# EAGLE design smd-proto (EAGLE 8.0.0)
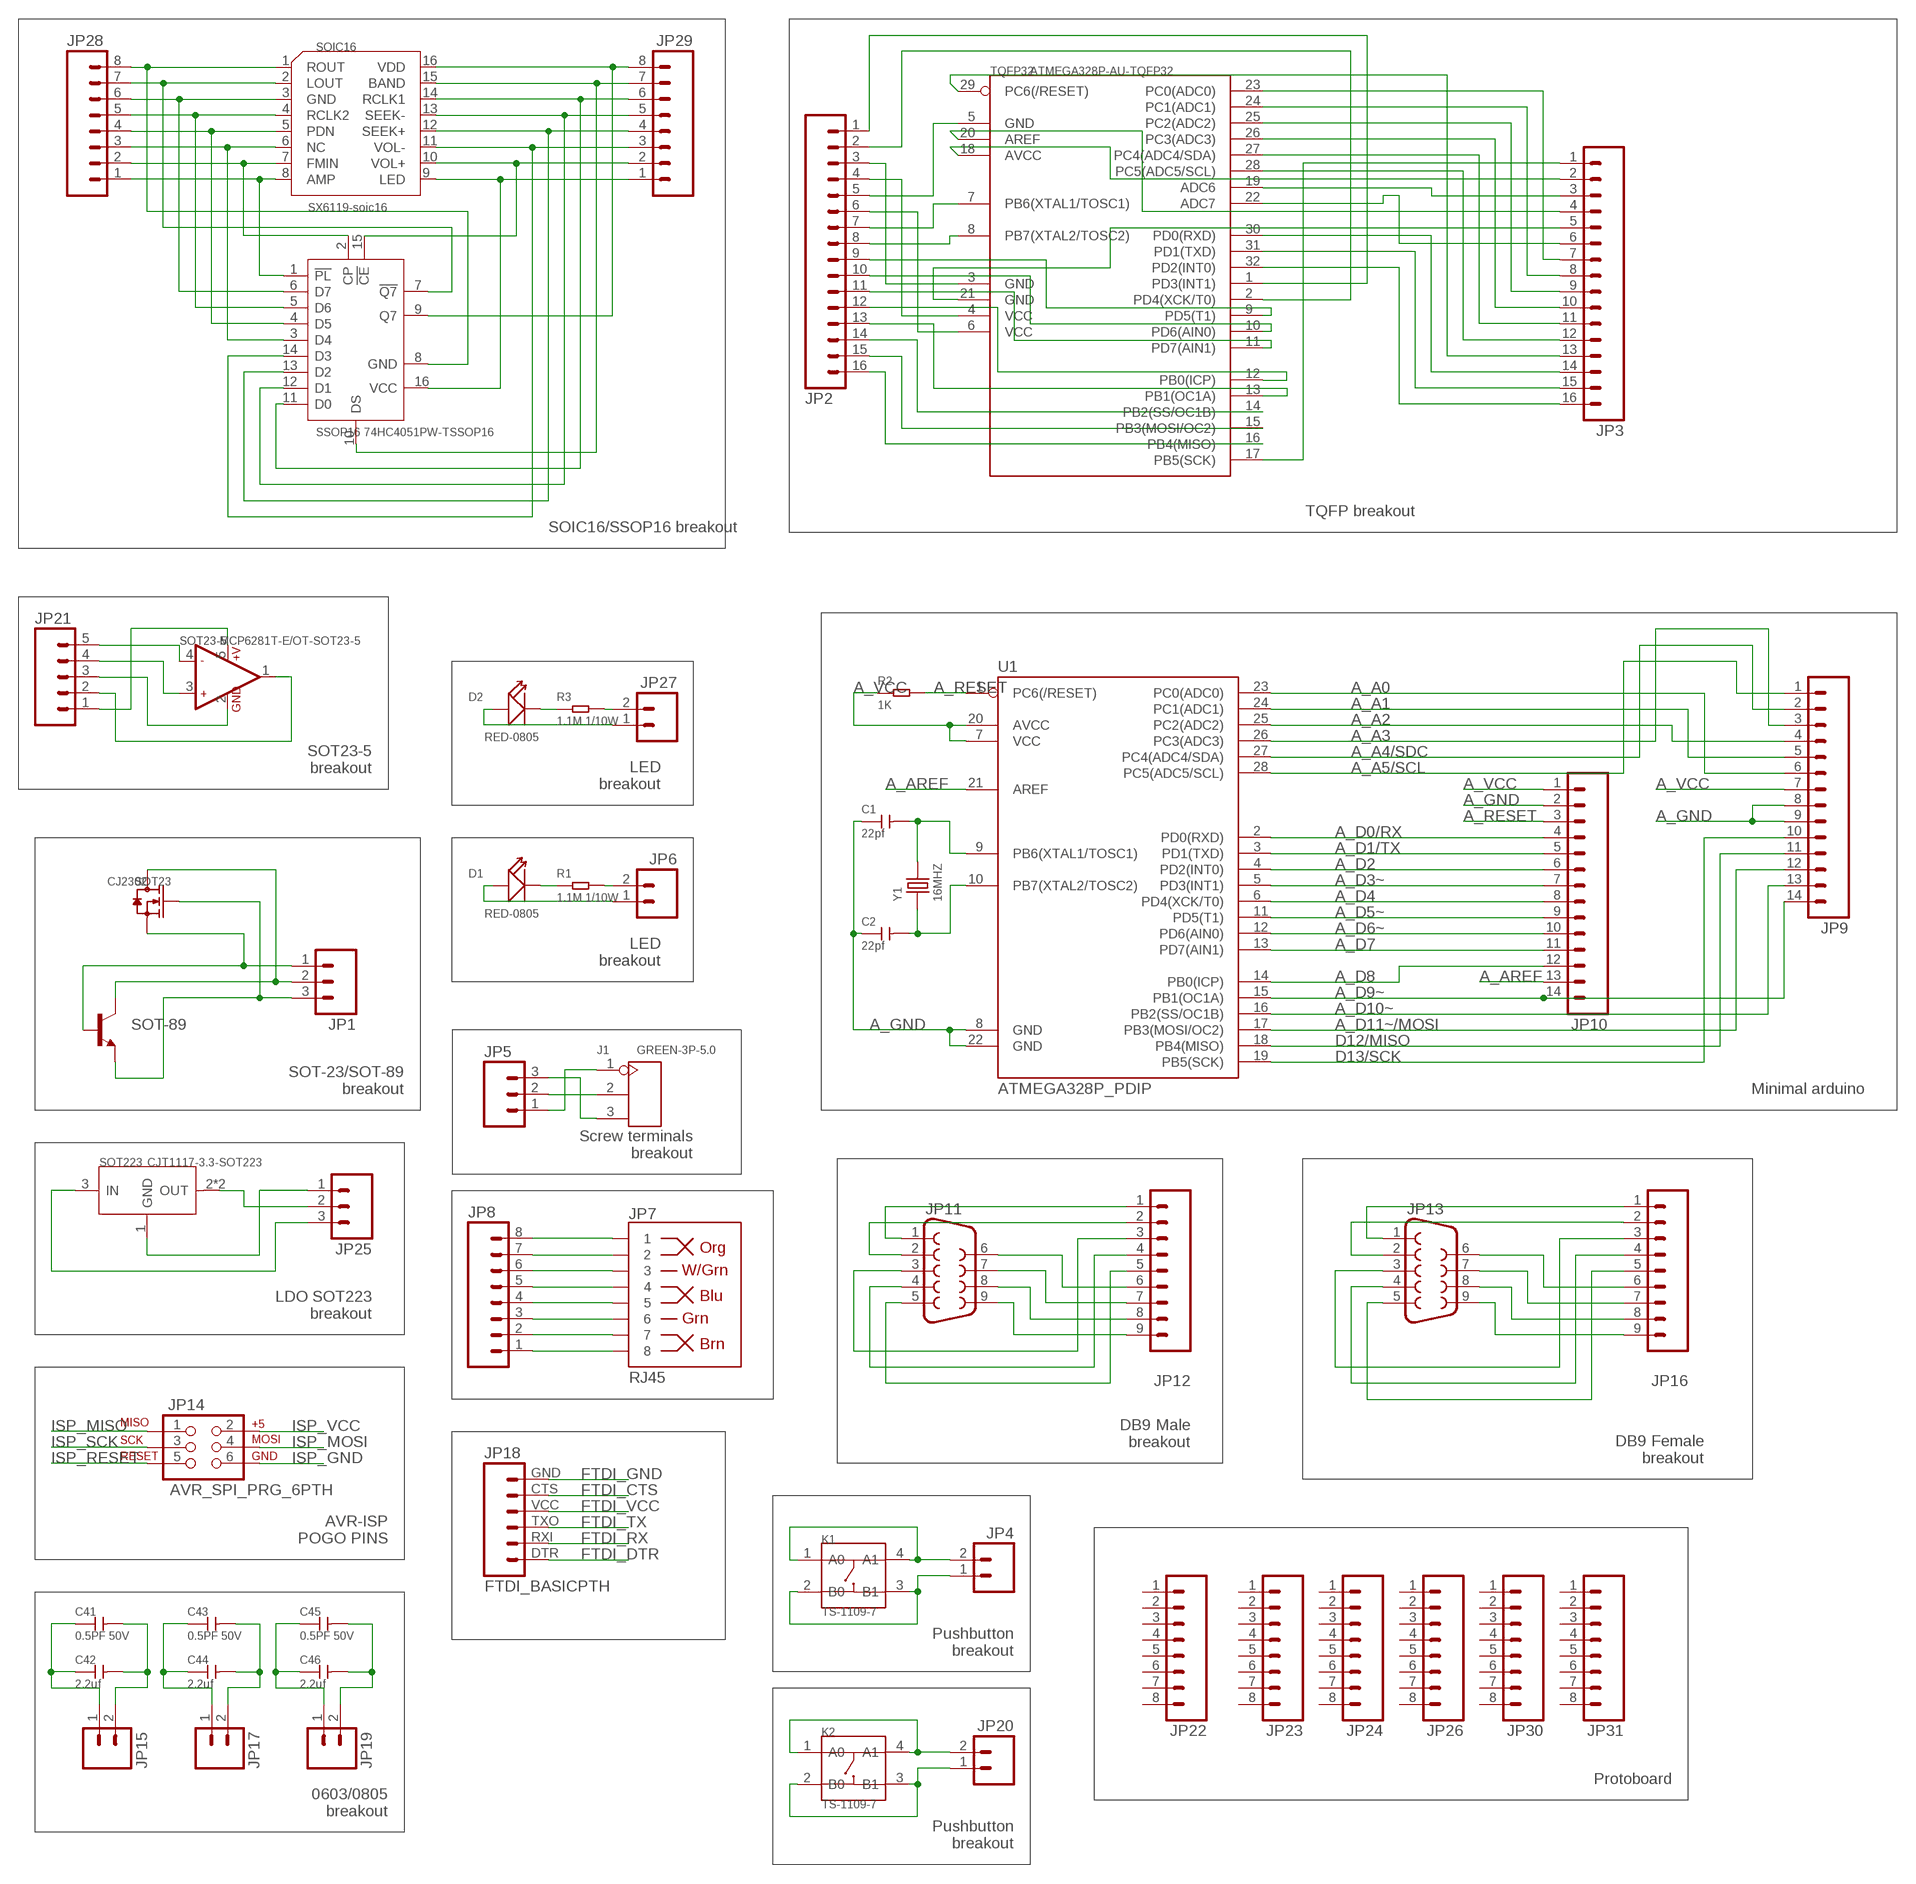
[diagram p0: schematic, sheet 1]

## Parts
C1  22pf  CERAMIC-22PF-50V-5%-NPO(0603)  [C0603]
C2  22pf  CERAMIC-22PF-50V-5%-NPO(0603)  [C0603]
C41  0.5PF 50V  CERAMIC-0.5PF-50V-0.1PF-NPO(0603)  [C0603]
C42  2.2uf  CERAMIC-2.2UF-25V-10%-X7R(0805)  [C0805]
C43  0.5PF 50V  CERAMIC-0.5PF-50V-0.1PF-NPO(0603)  [C0603]
C44  2.2uf  CERAMIC-2.2UF-25V-10%-X7R(0805)  [C0805]
C45  0.5PF 50V  CERAMIC-0.5PF-50V-0.1PF-NPO(0603)  [C0603]
C46  2.2uf  CERAMIC-2.2UF-25V-10%-X7R(0805)  [C0805]
D1  RED-0805  SMD-LED-CLEAR-RED(0805)  [LED-0805]
D2  RED-0805  SMD-LED-CLEAR-RED(0805)  [LED-0805]
J1  GREEN-3P-5.0  SCREW-TERMINAL-GREEN(3P-5.0)  [H3-5.0-15.5X8.0MM]
JP1  M03PTH  [1X03]
JP2  M16PTH  [1X16]
JP3  M16PTH  [1X16]
JP4  M02PTH  [1X02]
JP5  M03PTH  [1X03]
JP6  M02PTH  [1X02]
JP7  RJ45  RJ45-8PTH  [RJ45-8]
JP8  M08  [1X08_ROUND]
JP9  M14  [1X14]
JP10  M14  [1X14]
JP11  DB9MALE  [DB9_MALE]
JP12  M09  [1X09]
JP13  DB9FEMALE  [DB9]
JP14  AVR_SPI_PRG_6PTH  [2X3]
JP15  M02PTH  [1X02]
JP16  M09  [1X09]
JP17  M02PTH  [1X02]
JP18  FTDI_BASICPTH  [FTDI_BASIC]
JP19  M02PTH  [1X02]
JP20  M02PTH  [1X02]
JP21  M05PTH  [1X05]
JP22  M08NO_SILK_FEMALE_PTH  [1X08_NO_SILK]
JP23  M08NO_SILK_FEMALE_PTH  [1X08_NO_SILK]
JP24  M08NO_SILK_FEMALE_PTH  [1X08_NO_SILK]
JP25  M03PTH  [1X03]
JP26  M08NO_SILK_FEMALE_PTH  [1X08_NO_SILK]
JP27  M02PTH  [1X02]
JP28  M08  [1X08_ROUND]
JP29  M08  [1X08_ROUND]
JP30  M08NO_SILK_FEMALE_PTH  [1X08_NO_SILK]
JP31  M08NO_SILK_FEMALE_PTH  [1X08_NO_SILK]
K1  TS-1109-7  DIP-BUTTON-TOP-BLACK(4P-D6.2MM)  [SW4-6.2X6.2X5.0MM]
K2  TS-1109-7  DIP-BUTTON-TOP-BLACK(4P-D6.2MM)  [SW4-6.2X6.2X5.0MM]
R1  1.1M 1/10W  SMD-RES-1.1M-1%-1/10W(0603)  [R0603]
R2  1K  SMD-RES-5.6K-5%-1/10W(0603)  [R0603]
R3  1.1M 1/10W  SMD-RES-1.1M-1%-1/10W(0603)  [R0603]
SOIC16  SX6119-soic16  AMPLIFIER-SX6119(SOIC16)  [SOIC16-1.27-10X3.9MM]
SOT23  CJ2302  SMD-MOSFET-N-CH-20V-2.1A-CJ2302(SOT-23)  [SOT-23]
SOT23-5  MCP6281T-E/OT-SOT23-5  AMPLIFIER-MCP6281T-E/OT(SOT23-5)  [SOT-23-5]
SOT223  CJT1117-3.3-SOT223  PMIC-CJT1117-3.3(SOT223)  [SOT-223]
SOT-89  TRANSISTOR_NPNSOT89  [SOT89]
SSOP16  74HC4051PW-TSSOP16  LOGIC-74HC4051PW(TSSOP16)  [TSSOP16-0.65-5X4.4MM]
TQFP32  ATMEGA328P-AU-TQFP32  MCU-ATMEGA328P-AU(TQFP32)  [TQFP32-0.8-7X7MM]
U1  ATMEGA328P_PDIP  [DIL28-3]
Y1  16MHZ  SMD-CRYSTAL-16MHZ-8PF-20PPM-40R(2P-5.0X3.2MM)  [X2-SMD-5.0X3.2X1.3MM]

## Nets
A_A0: JP9.6 U1.23(PC0(ADC0))
A_A1: JP9.5 U1.24(PC1(ADC1))
A_A2: JP9.4 U1.25(PC2(ADC2))
A_A3: JP9.3 U1.26(PC3(ADC3))
A_A4/SDC: JP9.2 U1.27(PC4(ADC4/SDA))
A_A5/SCL: JP9.1 U1.28(PC5(ADC5/SCL))
A_AREF: JP10.13 U1.21(AREF)
A_D0/RX: JP10.4 U1.2(PD0(RXD))
A_D1/TX: JP10.5 U1.3(PD1(TXD))
A_D2: JP10.6 U1.4(PD2(INT0))
A_D3~: JP10.7 U1.5(PD3(INT1))
A_D4: JP10.8 U1.6(PD4(XCK/T0))
A_D5~: JP10.9 U1.11(PD5(T1))
A_D6~: JP10.10 U1.12(PD6(AIN0))
A_D7: JP10.11 U1.13(PD7(AIN1))
A_D8: JP10.12 U1.14(PB0(ICP))
A_D9~: JP9.14 JP10.14 U1.15(PB1(OC1A))
A_D10~: JP9.13 U1.16(PB2(SS/OC1B))
A_D11~/MOSI: JP9.12 U1.17(PB3(MOSI/OC2))
A_GND: C1.1 C2.1 JP9.8 JP9.9 JP10.2 U1.8(GND) U1.22(GND)
A_RESET: JP10.3 R2.2 U1.1(PC6(/RESET))
A_VCC: JP9.7 JP10.1 R2.1 U1.7(VCC) U1.20(AVCC)
D12/MISO: JP9.11 U1.18(PB4(MISO))
D13/SCK: JP9.10 U1.19(PB5(SCK))
FTDI_CTS: JP18.CTS
FTDI_DTR: JP18.DTR
FTDI_GND: JP18.GND
FTDI_RX: JP18.RXI
FTDI_TX: JP18.TXO
FTDI_VCC: JP18.VCC
GND: JP28.8 SOIC16.1(ROUT) SSOP16.8(GND)
ISP_GND: JP14.6
ISP_MISO: JP14.1
ISP_MOSI: JP14.4
ISP_RESET: JP14.5
ISP_SCK: JP14.3
ISP_VCC: JP14.2
N$1: JP21.5 SOT23-5.4(-IN1)
N$2: JP2.1 TQFP32.1(PD3(INT1))
N$3: JP2.2 TQFP32.2(PD4(XCK/T0))
N$4: JP2.3 TQFP32.3(GND)
N$5: JP2.4 TQFP32.4(VCC)
N$6: JP2.5 TQFP32.5(GND)
N$7: JP2.6 TQFP32.6(VCC)
N$8: JP2.7 TQFP32.7(PB6(XTAL1/TOSC1))
N$9: JP2.8 TQFP32.8(PB7(XTAL2/TOSC2))
N$10: JP2.9 TQFP32.9(PD5(T1))
N$11: JP2.11 TQFP32.11(PD7(AIN1))
N$12: JP2.10 TQFP32.10(PD6(AIN0))
N$13: JP2.12 TQFP32.12(PB0(ICP))
N$14: JP2.13 TQFP32.13(PB1(OC1A))
N$15: JP2.14 TQFP32.14(PB2(SS/OC1B))
N$16: JP21.2 SOT23-5.1(OUT1)
N$17: JP21.1 SOT23-5.5(+V)
N$18: JP2.15 TQFP32.15(PB3(MOSI/OC2))
N$19: JP21.4 SOT23-5.3(+IN1)
N$20: JP21.3 SOT23-5.2(GND)
N$21: JP1.3 SOT23.1(G) SOT-89.3(E)
N$22: JP2.16 TQFP32.16(PB4(MISO))
N$23: JP1.2 SOT23.3(D) SOT-89.2(C)
N$24: JP3.1 TQFP32.17(PB5(SCK))
N$25: JP3.2 TQFP32.18(AVCC)
N$26: JP29.6 SOIC16.14(RCLK1) SSOP16.11(D0)
N$27: JP3.3 TQFP32.19(ADC6)
N$28: JP3.4 TQFP32.20(AREF)
N$29: JP3.5 TQFP32.21(GND)
N$30: JP3.6 TQFP32.22(ADC7)
N$31: JP3.7 TQFP32.23(PC0(ADC0))
N$32: JP3.8 TQFP32.24(PC1(ADC1))
N$33: JP3.9 TQFP32.25(PC2(ADC2))
N$34: JP3.10 TQFP32.26(PC3(ADC3))
N$35: JP3.11 TQFP32.27(PC4(ADC4/SDA))
N$36: JP3.12 TQFP32.28(PC5(ADC5/SCL))
N$37: JP3.13 TQFP32.29(PC6(/RESET))
N$38: JP3.14 TQFP32.30(PD0(RXD))
N$39: JP3.15 TQFP32.31(PD1(TXD))
N$40: JP3.16 TQFP32.32(PD2(INT0))
N$41: JP4.1 K1.2(B0) K1.3(B1)
N$42: JP29.3 SOIC16.11(VOL-) SSOP16.14(D3)
N$43: C41.1 C42.1 JP15.1
N$44: C41.2 C42.2 JP15.2
N$45: C43.1 C44.1 JP17.1
N$46: C43.2 C44.2 JP17.2
N$47: C45.1 C46.1 JP19.1
N$48: JP28.7 SOIC16.2(LOUT) SSOP16.7(!Q7)
N$49: JP28.2 SOIC16.7(FMIN) SSOP16.2(CP)
N$50: C45.2 C46.2 JP19.2
N$51: JP29.7 SOIC16.15(BAND) SSOP16.10(DS)
N$52: JP4.2 K1.1(A0) K1.4(A1)
N$53: JP29.5 SOIC16.13(SEEK-) SSOP16.12(D1)
N$54: JP29.4 SOIC16.12(SEEK+) SSOP16.13(D2)
N$55: D1.+ JP6.1
N$56: D1.- R1.1
N$57: JP28.6 SOIC16.3(GND) SSOP16.6(D7)
N$58: JP6.2 R1.2
N$59: JP28.5 SOIC16.4(RCLK2) SSOP16.5(D6)
N$60: J1.2 JP5.2
N$61: J1.1 JP5.1
N$62: J1.3 JP5.3
N$63: JP7.1 JP8.8
N$64: JP7.2 JP8.7
N$65: JP7.3 JP8.6
N$66: JP7.4 JP8.5
N$67: JP7.5 JP8.4
N$68: JP7.6 JP8.3
N$69: JP7.7 JP8.2
N$70: JP1.1 SOT23.2(S) SOT-89.1(B)
N$71: JP28.4 SOIC16.5(PDN) SSOP16.4(D5)
N$72: JP7.8 JP8.1
N$73: C1.2 U1.9(PB6(XTAL1/TOSC1)) Y1.2
N$74: C2.2 U1.10(PB7(XTAL2/TOSC2)) Y1.1
N$75: JP28.3 SOIC16.6(NC) SSOP16.3(D4)
N$76: JP11.1 JP12.1
N$77: JP11.2 JP12.2
N$78: JP11.3 JP12.3
N$79: JP11.4 JP12.4
N$80: JP28.1 SOIC16.8(AMP) SSOP16.1(!PL)
N$82: JP11.5 JP12.5
N$83: JP11.6 JP12.6
N$84: JP11.7 JP12.7
N$85: JP11.8 JP12.8
N$86: JP11.9 JP12.9
N$87: JP13.1 JP16.1
N$88: JP13.2 JP16.2
N$89: JP13.3 JP16.3
N$90: JP13.4 JP16.4
N$91: JP13.5 JP16.5
N$92: JP13.6 JP16.6
N$93: JP13.7 JP16.7
N$94: JP13.8 JP16.8
N$95: JP13.9 JP16.9
N$97: JP29.2 SOIC16.10(VOL+) SSOP16.15(!CE)
N$103: JP20.1 K2.2(B0) K2.3(B1)
N$104: JP20.2 K2.1(A0) K2.4(A1)
N$105: D2.+ JP27.1
N$106: D2.- R3.1
N$107: JP25.2 SOT223.2(OUT) SOT223.TER(OUT)
N$108: JP27.2 R3.2
N$111: JP29.8 SOIC16.16(VDD) SSOP16.9(Q7)
N$304: JP25.1 SOT223.1(GND)
N$306: JP25.3 SOT223.3(IN)
VCC: JP29.1 SOIC16.9(LED) SSOP16.16(VCC)
Unconnected: JP22.1 JP22.2 JP22.3 JP22.4 JP22.5 JP22.6 JP22.7 JP22.8 JP23.1 JP23.2 JP23.3 JP23.4 JP23.5 JP23.6 JP23.7 JP23.8 JP24.1 JP24.2 JP24.3 JP24.4 JP24.5 JP24.6 JP24.7 JP24.8 JP26.1 JP26.2 JP26.3 JP26.4 JP26.5 JP26.6 JP26.7 JP26.8 JP30.1 JP30.2 JP30.3 JP30.4 JP30.5 JP30.6 JP30.7 JP30.8 JP31.1 JP31.2 JP31.3 JP31.4 JP31.5 JP31.6 JP31.7 JP31.8

## Notes on the sheet
- TQFP breakout
- SOIC16/SSOP16 breakout
- SOT23-5
  breakout
- LED
  breakout
- LED
  breakout
- SOT-23/SOT-89
  breakout
- Minimal arduino
- Screw terminals
  breakout
- LDO SOT223
  breakout
- DB9 Male
  breakout
- DB9 Female
  breakout
- AVR-ISP
  POGO PINS
- Pushbutton
  breakout
- Protoboard
- 0603/0805
  breakout
- Pushbutton
  breakout

## Library data of the parts
C1 C2 = Seeed-OPL-Capacitor:CERAMIC-22PF-50V-5%-NPO(0603): 302010143
C41 C43 C45 = Seeed-OPL-Capacitor:CERAMIC-0.5PF-50V-0.1PF-NPO(0603): 302010115
C42 C44 C46 = Seeed-OPL-Capacitor:CERAMIC-2.2UF-25V-10%-X7R(0805): 302010148; MPN: CC0805KKX7R8BB225
D1 D2 = Seeed-OPL-Diode:SMD-LED-CLEAR-RED(0805): 304090046; MPN: 17-215SURC/S530-A2/TR8
J1 = Seeed-OPL-Connector:SCREW-TERMINAL-GREEN(3P-5.0): 320110029
JP1 JP5 JP25 = SparkFun-Connectors:M03: Header 3 Standard 3-pin 0.1" header. Use with straight break away headers (SKU : PRT-00116), right angle break away headers (PRT-00553), swiss pins (PRT-00743), machine pins (PRT-00117), and female headers (PRT-00115). Molex polarized connector foot print use with SKU : PRT-08232 with associated crimp pins and housings.
JP2 JP3 = SparkFun-Connectors:M16: 1x16 .1" header
JP4 JP6 JP15 JP17 JP19 JP20 JP27 = SparkFun-Connectors:M02: Standard 2-pin 0.1" header. Use with - straight break away headers ( PRT-00116) - right angle break away headers (PRT-00553) - swiss pins (PRT-00743) - machine pins (PRT-00117) - female headers (PRT-00115) Molex polarized connector foot print use with: PRT-08233 with associated crimp pins and housings. 2.54_SCREWTERM for use with PRT-10571. 3.5mm Screw Terminal footprints for PRT-08084 5mm Screw Terminal footprints for use with PRT-08432
JP7 = SparkFun-Connectors:RJ45-8: RJ45 Jack Simple RJ45, 8-pin connection - connector for common Cat5, Cat5e, and Cat6 Ethernet cables. Footprint not yet proven in production. Connector sku is PRT-00643; Breakout PCB sku is BOB-00716.; PROD_ID: CONN-08506
JP8 JP28 JP29 = SparkFun-Connectors:M08: Header 8 Standard 8-pin 0.1" header. Use with straight break away headers (SKU : PRT-00116), right angle break away headers (PRT-00553), swiss pins (PRT-00743), machine pins (PRT-00117), and female headers (PRT-00115).
JP9 JP10 = SparkFun-Connectors:M14: Header 14 Standard 14-pin 0.1" header. Use with straight break away headers (SKU : PRT-00116), right angle break away headers (PRT-00553), swiss pins (PRT-00743), machine pins (PRT-00117), and female headers (PRT-00115).
JP11 = SparkFun-Connectors:DB9: DB9 Connector Standard DB9 (D-Sub 9) serial connector. Can be used for CAN bus as well as RS485 and RS232. Footprint production proven. Spark Fun Electronics SKU : PRT-00429; PROD_ID: CONN-09904
JP12 JP16 = SparkFun-Connectors:M09: Header 9 Standard 9-pin 0.1" header. Use with straight break away headers (SKU : PRT-00116), right angle break away headers (PRT-00553), swiss pins (PRT-00743), machine pins (PRT-00117), and female headers (PRT-00115).
JP13 = SparkFun-Connectors:DB9: DB9 Connector Standard DB9 (D-Sub 9) serial connector. Can be used for CAN bus as well as RS485 and RS232. Footprint production proven. Spark Fun Electronics SKU : PRT-00429; PROD_ID: CONN-08194
JP14 = SparkFun-Connectors:AVR_SPI_PRG_6: AVR ISP 6 Pin This is the reduced ISP connector for AVR programming. Common on Arduino. This footprint will take up less PCB space and can be used with a 10-pin to 6-pin adapter such as SKU: BOB-08508 **Special note about "TEST_POINT" package. The stop mask is on the top side, so if you want your programming test points to be on the bottom of your board, make sure to place this package on the bottom side of the board. This also ensure that the orientation to program from the bottom side will be correct.
JP18 = SparkFun-Connectors:FTDI_BASIC: FTDI Basic header with labels
JP21 = SparkFun-Connectors:M05: Header 5 Standard 5-pin 0.1" header. Use with straight break away headers (SKU : PRT-00116), right angle break away headers (PRT-00553), swiss pins (PRT-00743), machine pins (PRT-00117), and female headers (PRT-00115). Molex polarized connector foot print use with SKU : PRT-08230 with associated crimp pins and housings.
JP22-JP24 JP26 JP30 JP31 = SparkFun-Connectors:M08: Header 8 Standard 8-pin 0.1" header. Use with straight break away headers (SKU : PRT-00116), right angle break away headers (PRT-00553), swiss pins (PRT-00743), machine pins (PRT-00117), and female headers (PRT-00115).; PROD_ID: CONN-08438
K1 K2 = Seeed-OPL-Switch:DIP-BUTTON-TOP-BLACK(4P-D6.2MM): 311020032; MPN: TS-1109-7
R1 R3 = Seeed-OPL-Resistor:SMD-RES-1.1M-1%-1/10W(0603): 301010236; MPN: RC0603FR-071M1L
R2 = Seeed-OPL-Resistor:SMD-RES-5.6K-5%-1/10W(0603): 301010166; MPN: RC0603JR-075K6L; VALUE: 5.6K
SOIC16 = Seeed-OPL-ic:AMPLIFIER-SX6119(SOIC16): 310060020; MPN: SX6119
SOT23 = Seeed-OPL-Transistor:SMD-MOSFET-N-CH-20V-2.1A-CJ2302(SOT-23): 305030015; MPN: CJ2302
SOT23-5 = Seeed-OPL-ic:AMPLIFIER-MCP6281T-E/OT(SOT23-5): 310020012; MPN: MCP6281T-E/OT
SOT223 = Seeed-OPL-ic:PMIC-CJT1117-3.3(SOT223): 310030097; MPN: CJT1117-3.3
SOT-89 = SparkFun-DiscreteSemi:TRANSISTOR_NPN: Generic NPN BJT MMBT2222A - TRANS-08049 (SOT-23, 1A 40V) MPSA42 - TRANS-09116 (SOT-23, 500mA 300V) MMBT5088LT1G - TRANS-11160 (SOT-23, 50 mA 30V) BC547 - COM-08928 (TO-92 45V 100mA) (1.Collector 2.Base 3.Emitter) 2N3904 - COM-00521 (TO-92 40V 200mA) (1.Emitter 2.Base 3.Collector) P2N2222A - COM-12852 (TO-92 40V 600mA) (1.Collector 2.Base 3.Emitter)
SSOP16 = Seeed-OPL-ic:LOGIC-74HC4051PW(TSSOP16): 310070017; MPN: 74HC4051PW
TQFP32 = Seeed-OPL-ic:MCU-ATMEGA328P-AU(TQFP32): 310010049; MPN: ATMEGA328P-AU
U1 = SparkFun-DigitalIC:ATMEGA328P_PDIP: uC used in the Arduino 32kb flash, 1k EEPROM, 2k SRAM This is the through-hole version of this chip.
Y1 = Seeed-OPL-crystal-osctllator:SMD-CRYSTAL-16MHZ-8PF-20PPM-40R(2P-5.0X3.2MM): 306010054; MPN: X053201602002

## Board
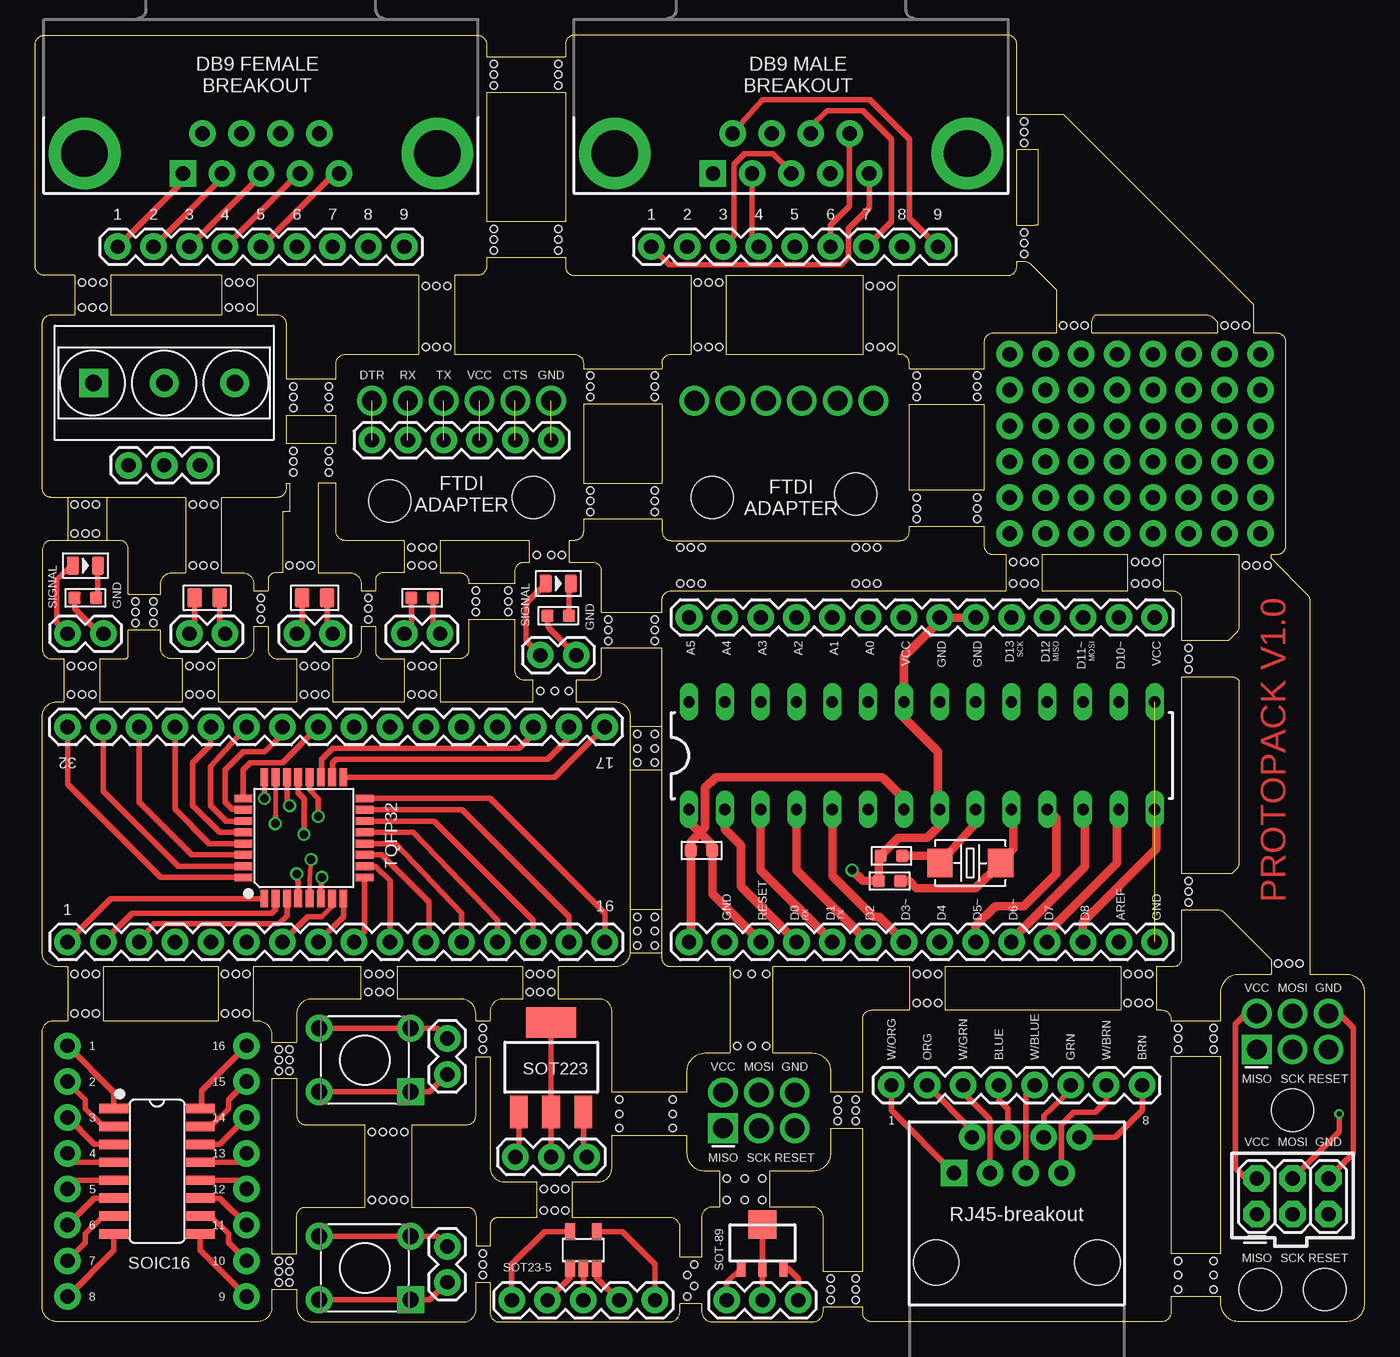
[diagram p1: board, top side]
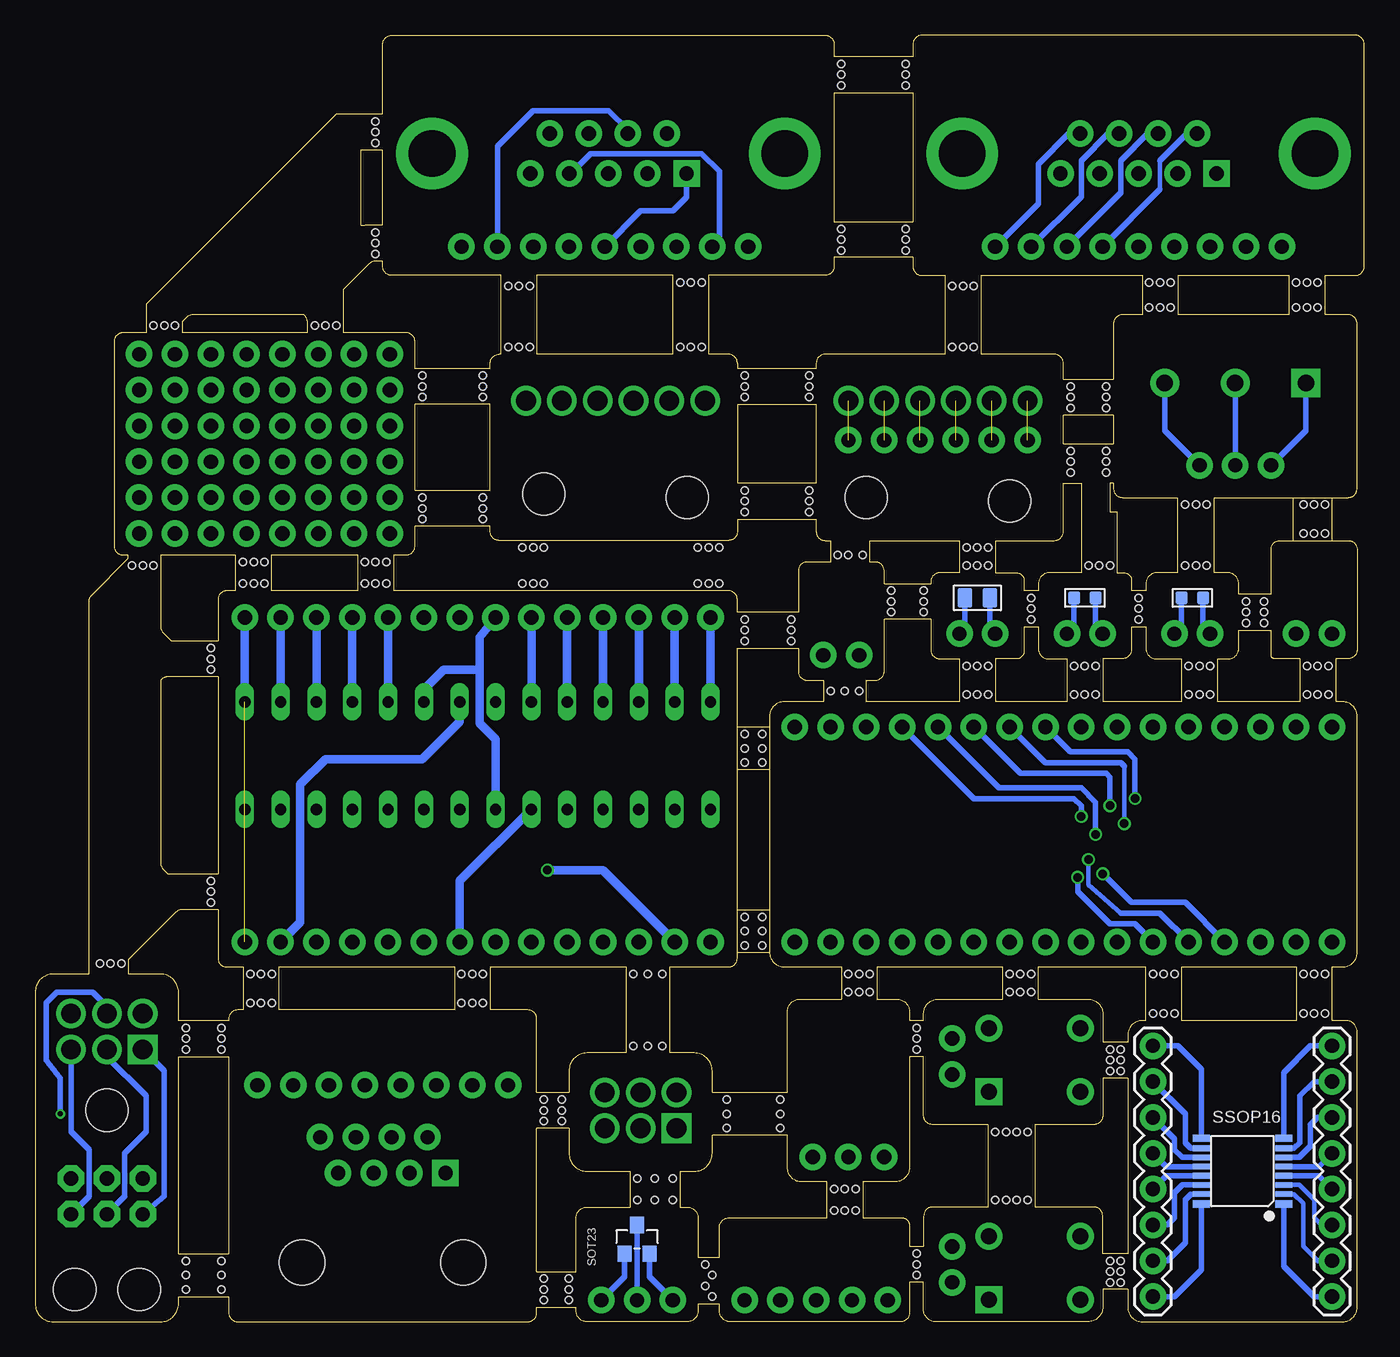
[diagram p2: board, bottom side, seen from below]

Size 94.23 x 91.19 mm. Coordinates in mm from the lower left corner, seen from the top.
Outline: 438 segments
Copper layers (1*16): Top 0.035mm / dielectric 1.5mm / Bottom 0.035mm
Design rules "dirt_cheap_dirty_boards.v1": minimum track width 5mil, minimum drill 12mil, track to track 5mil, track to pad 5mil, pad to pad 5mil, via to via 5mil, smd to smd 0mil, copper to edge 10mil, drill to drill 10mil, minimum pad ring 10mil, minimum via ring 6mil, stop-mask expansion 2mil, vias tented up to drill 25mil, thermal gap 10mil
Holes 0.5 mm at 17.27,19.3 17.27,18.54 17.27,17.78 18.03,19.3 18.03,18.54 18.03,17.78 17.27,2.79 17.27,3.56 17.27,4.32 18.03,4.32 18.03,3.56 18.03,2.79 2.79,21.84 3.56,21.84 4.32,21.84 2.79,24.64 3.56,24.64 4.32,24.64 14.99,21.84 14.22,21.84 13.46,21.84 14.99,24.64 14.22,24.64 13.46,24.64 23.62,23.37 24.38,23.37 25.15,23.37 25.15,24.64 24.38,24.64 23.62,24.64 31.75,20.83 31.75,20.07 31.75,19.3 31.75,4.83 31.75,4.06 31.75,3.3 35.05,24.64 35.81,24.64 36.58,24.64 36.58,23.37 35.81,23.37 35.05,23.37 36.07,9.4 36.83,9.4 37.59,9.4 37.59,7.87 36.83,7.87 36.07,7.87 23.88,13.46 24.64,13.46 25.4,13.46 26.16,13.46 23.88,8.64 24.64,8.64 25.4,8.64 26.16,8.64 46.23,3.3 46.74,2.54 46.23,1.78 49.02,8.64 50.29,8.64 51.56,8.64 41.4,13.72 41.4,14.73 41.4,15.75 45.21,15.75 45.21,14.73 45.21,13.72 49.02,10.16 50.29,10.16 51.56,10.16 49.78,19.56 50.8,19.56 51.82,19.56 51.82,24.64 50.8,24.64 49.78,24.64 56.9,15.75 56.9,14.99 56.9,14.22 58.17,14.22 58.17,14.99 58.17,15.75 56.39,3.05 56.39,2.29 56.39,1.52 58.17,3.05 58.17,2.29 58.17,1.52 81.03,2.29 81.03,3.3 81.03,4.32 83.57,2.29 83.57,3.3 83.57,4.32 81.03,20.83 81.03,20.07 81.03,19.3 83.57,19.3 83.57,20.07 83.57,20.83 81.79,31.24 81.79,30.48 81.79,29.72 78.99,24.64 78.23,24.64 77.47,24.64 64.01,22.61 63.25,22.61 62.48,22.61 62.48,24.64 63.25,24.64 64.01,24.64 42.67,26.67 42.67,27.69 42.67,28.7 43.94,27.69 43.94,26.67 43.94,28.7 42.67,39.62 42.67,40.64 42.67,41.66 43.94,40.64 43.94,39.62 43.94,41.66 23.62,51.31 23.62,49.78 16,49.78 16,51.31 2.54,46.48 7.11,49.53 7.11,51.05 8.38,51.05 8.38,49.53 3.3,46.48 4.06,46.48 4.06,44.45 3.3,44.45 2.54,44.45 10.92,46.48 11.68,46.48 12.45,46.48 12.45,44.45 11.68,44.45 10.92,44.45 19.05,46.48 19.81,46.48 20.57,46.48 20.57,44.45 19.81,44.45 19.05,44.45 26.67,46.48 27.43,46.48 28.19,46.48 28.19,44.45 27.43,44.45 26.67,44.45 26.67,54.86 27.43,54.86 28.19,54.86 28.19,53.59 27.43,53.59 26.67,53.59 2.79,57.91 3.56,57.91 4.32,57.91 4.32,55.88 3.56,55.88 2.79,55.88 45.72,54.86 46.48,54.86 47.24,54.86 47.24,52.32 46.48,52.32 45.72,52.32 58.17,54.86 58.93,54.86 59.69,54.86 59.69,52.32 58.93,52.32 58.17,52.32 59.18,73.41 59.94,73.41 60.71,73.41 60.71,69.09 59.94,69.09 59.18,69.09 46.99,73.66 47.75,73.66 48.51,73.66 48.51,69.09 47.75,69.09 46.99,69.09 27.69,73.41 28.45,73.41 29.21,73.41 29.21,69.09 28.45,69.09 27.69,69.09 3.3,73.66 4.06,73.66 4.83,73.66 4.83,71.88 4.06,71.88 3.3,71.88 13.72,73.66 14.48,73.66 15.24,73.66 15.24,71.88 14.48,71.88 13.72,71.88 11.18,57.91 11.94,57.91 12.7,57.91 12.7,53.59 11.94,53.59 11.18,53.59 32.51,89.15 32.51,88.39 32.51,87.63 37.08,89.15 37.08,88.39 37.08,87.63 32.51,77.47 32.51,76.71 32.51,75.95 37.08,77.47 37.08,76.71 37.08,75.95 18.29,66.29 18.29,65.53 18.29,64.77 20.83,66.29 20.83,65.53 20.83,64.77 18.29,61.72 18.29,60.96 18.29,60.2 20.83,61.72 20.83,60.96 20.83,60.2 62.48,67.06 62.48,66.29 62.48,65.53 66.8,67.06 66.8,66.29 66.8,65.53 62.48,58.42 62.48,57.66 62.48,56.9 66.8,58.42 66.8,57.66 66.8,56.9 39.37,67.06 39.37,66.29 39.37,65.53 43.94,67.06 43.94,66.29 43.94,65.53 39.37,58.93 39.37,58.17 39.37,57.4 43.94,58.93 43.94,58.17 43.94,57.4 70.87,53.85 70.1,53.85 69.34,53.85 70.87,52.32 70.1,52.32 69.34,52.32 79.5,52.32 78.74,52.32 77.98,52.32 79.5,53.85 78.74,53.85 77.98,53.85 19.56,53.59 18.8,53.59 18.03,53.59 7.11,50.29 8.38,50.29 16,50.55 23.62,50.55 89.66,25.4 88.9,25.4 88.14,25.4 87.38,53.59 86.61,53.59 85.85,53.59 81.79,46.23 81.79,46.99 81.79,47.75 77.47,22.61 78.23,22.61 78.99,22.61 70.1,83.57 70.1,84.33 70.1,85.09 84.33,70.61 85.09,70.61 85.85,70.61 70.1,77.22 70.1,76.45 70.1,75.69 72.9,70.61 73.66,70.61 74.42,70.61 46.74,4.06 35.81,44.7 36.83,44.7 37.85,44.7 35.56,54.36 36.58,54.36 37.34,54.36 33.53,51.82 33.53,51.05 33.53,50.29 31.24,50.29 31.24,51.05 31.24,51.82 40.64,49.78 40.64,49.02 40.64,48.26 43.94,48.26 43.94,49.02 43.94,49.78
Holes 3 mm at 89.15,14.99 86.87,2.29 91.44,2.29 25.15,58.17 35.31,58.42 48.01,58.42 58.17,58.67

### Footprints (pad centres in the part's own frame; a part is rotated, then mirrored left to right if it is on the bottom)
C0603 = smd 0.889 x 0.889: 1 0,0.762; 2 0,-0.762
C0805 = smd 1.397 x 1.016: 1 0,0.889; 2 0,-0.889
LED-0805 = smd 0.889 x 1.27: + -0.889,0; - 0.889,0
H3-5.0-15.5X8.0MM = drill 1.168 pad 2.032 square: 1 0,5 | drill 1.168 pad 2.032: 2 0,0; 3 0,-5
1X03 = drill 1.016 pad 1.88: 1 0,0; 2 2.54,0; 3 5.08,0
1X16 = drill 1.016 pad 1.88: 1 0,0; 2 2.54,0; 3 5.08,0; 4 7.62,0; 5 10.16,0; 6 12.7,0; 7 15.24,0; 8 17.78,0; 9 20.32,0; 10 22.86,0; 11 25.4,0; 12 27.94,0; 13 30.48,0; 14 33.02,0; 15 35.56,0; 16 38.1,0
1X02 = drill 1.016 pad 1.88: 1 0,0; 2 2.54,0
RJ45-8 = drill 1 pad 1.88 square: 1 -4.445,6.35 | drill 1 pad 1.88: 2 -3.175,8.89; 3 -1.905,6.35; 4 -0.635,8.89; 5 0.635,6.35; 6 1.905,8.89; 7 3.175,6.35; 8 4.445,8.89 | hole 3.2: -5.715,0; 5.715,0
1X08_ROUND = drill 1.016 pad 1.88: 1 0,0; 2 2.54,0; 3 5.08,0; 4 7.62,0; 5 10.16,0; 6 12.7,0; 7 15.24,0; 8 17.78,0
1X14 = drill 1.016 pad 1.88: 1 0,0; 2 2.54,0; 3 5.08,0; 4 7.62,0; 5 10.16,0; 6 12.7,0; 7 15.24,0; 8 17.78,0; 9 20.32,0; 10 22.86,0; 11 25.4,0; 12 27.94,0; 13 30.48,0; 14 33.02,0
DB9_MALE = drill 1.016 pad 1.88: 1 5.54,-1.42; 2 2.77,-1.42; 3 0,-1.42; 4 -2.77,-1.42; 6 4.15,1.42; 7 1.38,1.42; 8 -1.38,1.42; 9 -4.15,1.42 | drill 1.016 pad 1.88 square: 5 -5.54,-1.42 | drill 3.302 pad 5.08: G1 -12.5,0; G2 12.5,0
1X09 = drill 1.016 pad 1.88: 1 0,0; 2 2.54,0; 3 5.08,0; 4 7.62,0; 5 10.16,0; 6 12.7,0; 7 15.24,0; 8 17.78,0; 9 20.32,0
DB9 = drill 1.016 pad 1.88 square: 1 -5.54,-1.42 | drill 1.016 pad 1.88: 2 -2.77,-1.42; 3 0,-1.42; 4 2.77,-1.42; 5 5.54,-1.42; 6 -4.15,1.42; 7 -1.38,1.42; 8 1.38,1.42; 9 4.15,1.42 | drill 3.302 pad 5.08: G1 -12.5,0; G2 12.5,0
2X3 = drill 1.016 pad 1.88 octagon: 1 0,0; 2 0,2.54; 3 2.54,0; 4 2.54,2.54; 5 5.08,0; 6 5.08,2.54
FTDI_BASIC = drill 1.016 pad 1.88: CTS 10.16,0; DTR 0,0; GND 12.7,0; RXI 2.54,0; TXO 5.08,0; VCC 7.62,0
1X05 = drill 1.016 pad 1.88: 1 0,0; 2 2.54,0; 3 5.08,0; 4 7.62,0; 5 10.16,0
1X08_NO_SILK = drill 1.016 pad 1.88: 1 0,0; 2 2.54,0; 3 5.08,0; 4 7.62,0; 5 10.16,0; 6 12.7,0; 7 15.24,0; 8 17.78,0
SW4-6.2X6.2X5.0MM = drill 1.143 pad 1.905 square: 1 -3.25,2.25 | drill 1.143 pad 1.905: 2 -3.25,-2.25; 3 3.25,-2.25; 4 3.25,2.25
R0603 = smd 0.889 x 0.889: 1 0,0.762; 2 0,-0.762
SOIC16-1.27-10X3.9MM = smd 0.66 x 2.032: 1 -4.445,-3.073; 2 -3.175,-3.073; 3 -1.905,-3.073; 4 -0.635,-3.073; 5 0.635,-3.073; 6 1.905,-3.073; 7 3.175,-3.073; 8 4.445,-3.073; 9 4.445,3.073; 10 3.175,3.073; 11 1.905,3.073; 12 0.635,3.073; 13 -0.635,3.073; 14 -1.905,3.073; 15 -3.175,3.073; 16 -4.445,3.073
SOT-23 = smd 1.016 x 1.143: 1 -0.889,-1.016; 2 0.889,-1.016; 3 0,1.016
SOT-23-5 = smd 0.69 x 1.2: 1 -0.95,-1.3; 2 0,-1.3; 3 0.95,-1.3; 4 0.95,1.3; 5 -0.95,1.3
SOT-223 = smd 1.27 x 2.286: 1 -2.286,-3.175; 2 0,-3.175; 3 2.286,-3.175 | smd 3.556 x 2.159: TER 0,3.175
SOT89 = smd 0.58 x 1.2: 1 -1.5,-1.8; 2 0,-1.8; 3 1.5,-1.8 | smd 2 x 2: 4 0,1.3
TSSOP16-0.65-5X4.4MM = smd 0.5 x 1.2: 1 -2.325,-2.925; 8 2.325,-2.925; 9 2.325,2.925; 16 -2.325,2.925 | smd 0.4 x 1.2: 2 -1.625,-2.925; 3 -0.975,-2.925; 4 -0.325,-2.925; 5 0.325,-2.925; 6 0.975,-2.925; 7 1.625,-2.925; 10 1.625,2.925; 11 0.975,2.925; 12 0.325,2.925; 13 -0.325,2.925; 14 -0.975,2.925; 15 -1.625,2.925
TQFP32-0.8-7X7MM = smd 1.27 x 0.559: 1 -4.293,2.8; 2 -4.293,2; 3 -4.293,1.2; 4 -4.293,0.4; 5 -4.293,-0.4; 6 -4.293,-1.2; 7 -4.293,-2; 8 -4.293,-2.8; 17 4.293,-2.8; 18 4.293,-2; 19 4.293,-1.2; 20 4.293,-0.4; 21 4.293,0.4; 22 4.293,1.2; 23 4.293,2; 24 4.293,2.8 | smd 0.559 x 1.27: 9 -2.8,-4.293; 10 -2,-4.293; 11 -1.2,-4.293; 12 -0.4,-4.293; 13 0.4,-4.293; 14 1.2,-4.293; 15 2,-4.293; 16 2.8,-4.293; 25 2.8,4.293; 26 2,4.293; 27 1.2,4.293; 28 0.4,4.293; 29 -0.4,4.293; 30 -1.2,4.293; 31 -2,4.293; 32 -2.8,4.293
DIL28-3 = drill 0.813 long: 1 -16.51,-3.81; 2 -13.97,-3.81; 3 -11.43,-3.81; 4 -8.89,-3.81; 5 -6.35,-3.81; 6 -3.81,-3.81; 7 -1.27,-3.81; 8 1.27,-3.81; 9 3.81,-3.81; 10 6.35,-3.81; 11 8.89,-3.81; 12 11.43,-3.81; 13 13.97,-3.81; 14 16.51,-3.81; 15 16.51,3.81; 16 13.97,3.81; 17 11.43,3.81; 18 8.89,3.81; 19 6.35,3.81; 20 3.81,3.81; 21 1.27,3.81; 22 -1.27,3.81; 23 -3.81,3.81; 24 -6.35,3.81; 25 -8.89,3.81; 26 -11.43,3.81; 27 -13.97,3.81; 28 -16.51,3.81
X2-SMD-5.0X3.2X1.3MM = smd 1.778 x 2.032: 1 -2.159,0; 2 2.159,0

### Placement (x,y rotation side)
C1  60.71,33.02 90 top
C2  60.58,31.24 90 top
C41  27.43,51.31 270 top
C42  27.43,51.31 90 bottom
C43  12.19,51.31 90 bottom
C44  12.19,51.31 270 top
C45  19.81,51.31 270 bottom
C46  19.81,51.31 90 top
D1  3.56,53.59 0 top
D2  37.08,52.32 0 top
J1  9.14,66.55 90 top
JP1  49.02,1.52 0 top
JP2  2.29,26.92 0 top
JP3  40.39,42.16 180 top
JP4  29.21,20.07 270 top
JP5  6.6,60.71 0 top
JP6  2.29,48.77 0 top
JP7  69.6,4.19 0 top
JP8  78.49,16.76 180 top
JP9  46.35,49.91 0 top
JP10  46.35,26.92 0 top
JP11  53.59,82.8 0 top
JP12  43.69,76.2 0 top
JP13  16,82.8 0 top
JP14  86.61,7.62 0 top
JP15  28.7,48.77 180 top
JP16  5.84,76.2 0 top
JP17  13.46,48.77 180 top
JP18  23.88,62.48 0 top
JP19  18.54,48.77 0 top
JP20  29.21,5.33 270 top
JP21  33.78,1.52 0 top
JP22  69.09,68.58 0 top
JP23  69.09,66.04 0 top
JP24  69.09,63.5 0 top
JP25  34.04,11.68 0 top
JP26  69.09,60.96 0 top
JP27  35.81,47.24 0 top
JP28  2.29,1.78 90 bottom
JP29  14.99,1.78 90 bottom
JP30  69.09,58.42 0 top
JP31  69.09,55.88 0 top
K1  23.37,18.54 180 top
K2  23.37,3.81 180 top
R1  3.56,51.31 270 top
R2  47.24,33.4 90 top
R3  37.08,50.04 270 top
SOIC16  8.64,10.67 270 top
SOT23  51.56,5.84 0 bottom
SOT23-5  38.86,5.08 0 top
SOT223  36.58,18.03 0 top
SOT-89  51.56,5.59 0 top
SSOP16  8.64,10.67 90 bottom
TQFP32  19.05,34.29 90 top
U1  62.86,40.13 0 top
Y1  66.29,32.51 180 top

### Tracks (layer width: path | path; a pad name or v marks a point on that pad's centre or on a via)
A_A0
  Bottom 0.61: U1.23 JP9.6
A_A1
  Bottom 0.61: U1.24 JP9.5
A_A2
  Bottom 0.61: U1.25 JP9.4
A_A3
  Bottom 0.61: U1.26 JP9.3
A_A4/SDC
  Bottom 0.61: U1.27 JP9.2
A_A5/SCL
  Bottom 0.61: U1.28 JP9.1
A_AREF
  Bottom 0.61: U1.21 64.14,42.55 66.8,39.88 73.66,39.88 75.44,38.1 75.44,28.32 JP10.13
A_D0/RX
  Top 0.61: U1.2 48.89,34.93 50.04,33.78 50.04,30.86 JP10.4
A_D1/TX
  Top 0.61: U1.3 51.43,32 JP10.5
A_D2
  Top 0.61: U1.4 53.97,32 JP10.6
A_D3~
  Top 0.61: U1.5 56.52,31.62 59.44,28.7 59.82,28.7 JP10.7
A_D4
  Bottom 0.61: JP10.8 64.14,31.24 U1.6
A_D5~
  Top 0.61: JP10.9 66.68,28.07 68.07,29.46 70.1,29.46 72.39,31.75 72.39,35.69 U1.11
A_D6~
  Top 0.61: JP10.10 69.22,27.05 74.42,32.26 74.42,36.2 U1.12
A_D7
  Top 0.61: JP10.11 71.76,27.56 76.71,32.51 76.71,36.2 U1.13
A_D8
  Top 0.61: JP10.12 74.3,28.32 79.5,33.53 79.5,36.2 U1.14
A_D9~  (1 unrouted)
  Bottom 0.61: U1.15 JP9.14
A_D10~
  Bottom 0.61: U1.16 JP9.13
A_D11~/MOSI
  Bottom 0.61: U1.17 JP9.12
A_GND  (via drill 0.6)
  Top 0.61: v57.91,32 58.67,31.24 C2.1 59.82,32.89 C1.1 61.21,34.29 63.25,34.29 64.14,35.18 U1.8 64.01,36.45 64.01,40.39 61.59,42.8 U1.22 61.59,47.12 64.01,49.53 JP9.8 JP9.9
  Bottom 0.61: v57.91,32 53.97,32 JP10.2
A_RESET
  Top 0.61: U1.1 46.48,36.2 46.48,35.31 48.01,33.78 R2.2 48.01,30.35 JP10.3
A_VCC
  Top 0.61: JP10.1 46.48,27.05 R2.1 46.48,34.04 47.5,35.05 47.5,37.85 48.26,38.61 60.07,38.61 61.59,37.08 U1.7
  Bottom 0.61: U1.20 66.68,44.83 65.28,46.23 62.74,46.23 | U1.7 61.59,41.27 62.74,42.42 62.74,46.23 | JP9.7 62.74,48.51 62.74,46.23
D12/MISO
  Bottom 0.61: U1.18 JP9.11
D13/SCK
  Bottom 0.61: U1.19 JP9.10
FTDI_CTS  (via drill 1.4)  (1 unrouted)
  other vias: 34.04,65.28
FTDI_DTR  (via drill 1.4)  (1 unrouted)
  other vias: 23.88,65.28
FTDI_GND  (via drill 1.4)  (1 unrouted)
  other vias: 36.58,65.28
FTDI_RX  (via drill 1.4)  (1 unrouted)
  other vias: 26.42,65.28
FTDI_TX  (via drill 1.4)  (1 unrouted)
  other vias: 28.96,65.28
FTDI_VCC  (via drill 1.4)  (1 unrouted)
  other vias: 31.5,65.28
GND
  Top 0.406: SOIC16.1 5.56,16.28 JP28.8
  Bottom 0.406: SSOP16.8 5.71,17.66 3.81,19.56 JP28.8
ISP_GND  (via drill 1.4)
  Top 0.406: JP14.6 93.47,11.94 93.47,20.83 92.46,21.84 v91.69,21.84
ISP_GND1  (via drill 1.4)
  other vias: 53.85,16.26
ISP_MISO  (via drill 1.4)
  Bottom 0.406: JP14.1 85.09,8.89 85.09,17.78 v86.61,19.3
ISP_MISO1  (via drill 1.4)
  other vias: 48.77,13.72
ISP_MOSI  (via drill 0.36, 1.4)
  Top 0.406: JP14.4 92.46,13.46 v92.46,14.73
  Bottom 0.406: v92.46,14.73 92.46,17.27 93.47,18.54 93.47,22.61 92.71,23.37 90.17,23.37 89.15,22.35 v89.15,21.84
ISP_MOSI1  (via drill 1.4)
  other vias: 51.31,16.26
ISP_RESET  (via drill 1.4)
  Bottom 0.406: v91.69,19.3 91.69,13.46 90.42,12.19 90.42,8.89 JP14.5
ISP_RESET1  (via drill 1.4)
  other vias: 53.85,13.72
ISP_SCK  (via drill 1.4)
  Bottom 0.406: JP14.3 87.88,8.89 87.88,11.94 86.36,13.46 86.36,16 89.15,18.8 v89.15,19.3
ISP_SCK1  (via drill 1.4)
  other vias: 51.31,13.72
ISP_VCC  (via drill 1.4)
  Top 0.406: JP14.2 85.85,10.16 85.09,10.92 85.09,21.08 85.85,21.84 v86.61,21.84
ISP_VCC1  (via drill 1.4)
  other vias: 48.77,16.26
N$1
  Top 0.406: SOT23-5.4 41.63,6.38 43.94,4.06 JP21.5
N$2
  Top 0.406: TQFP32.1 5.36,30 JP2.1
N$3
  Top 0.406: TQFP32.2 17.05,29.24 16.76,28.96 6.86,28.96 JP2.2
N$4
  Top 0.406: TQFP32.3 17.85,28.77 17.27,28.19 8.38,28.19 JP2.3
N$5  (via drill 0.6)
  Top 0.406: TQFP32.4 18.65,31.13 v18.54,31.75
  Bottom 0.406: v18.54,31.75 16.51,29.72 12.7,29.72 JP2.4
N$6  (via drill 0.6)
  Top 0.305: TQFP32.5 19.45,31.39 v19.56,32.77
  Bottom 0.305: v19.56,32.77 19.56,30.99 17.27,28.96
  Bottom 0.406: 17.27,28.96 14.48,28.96 JP2.5
N$7  (via drill 0.6)
  Top 0.406: TQFP32.6 20.25,30.66 v20.32,31.5
  Bottom 0.406: v20.32,31.5 20.32,30.48 18.03,28.19 16.26,28.19 JP2.6
N$8
  Top 0.305: 21.05,29.43 20.32,28.7
  Top 0.406: TQFP32.7 21.05,29.43 | 20.32,28.7 19.3,28.7 JP2.7
N$9
  Top 0.406: TQFP32.8 21.85,28.71 JP2.8
N$10
  Top 0.406: TQFP32.9 23.34,27.66 JP2.9
N$11
  Top 0.406: TQFP32.11 24.57,33.09 27.94,29.72 27.94,27.18 JP2.11
N$12
  Top 0.406: TQFP32.10 24.1,32.29 25.15,31.24 JP2.10
N$13
  Top 0.406: TQFP32.12 25.55,33.89 30.23,28.96 JP2.12
N$14
  Top 0.406: TQFP32.13 26.78,34.69 32.77,28.45 JP2.13
N$15
  Top 0.406: TQFP32.14 28.26,35.49 35.31,28.45 JP2.14
N$16
  Top 0.406: JP21.2 37.91,3.11 SOT23-5.1
N$17
  Top 0.406: SOT23-5.5 36.1,6.38 33.78,4.06 JP21.1
N$18
  Top 0.406: TQFP32.15 30.26,36.29 37.85,28.7 JP2.15
N$19
  Top 0.406: JP21.4 39.81,3.11 SOT23-5.3
N$20
  Top 0.406: SOT23-5.2 JP21.3
N$21
  Top 0.406: SOT-89.3 53.36,3.79 54.1,3.05 JP1.3
  Bottom 0.406: SOT23.1 52.45,3.17 JP1.3
N$22
  Top 0.406: TQFP32.16 32.25,37.09 40.39,28.96 JP2.16
N$23
  Top 0.406: JP1.2 SOT-89.2 SOT23.3
  Bottom 0.406: SOT23.3 JP1.2
N$24
  Top 0.406: TQFP32.17 36.8,38.58 JP3.1
N$25
  Top 0.406: JP3.2 37.85,41.4 36.32,39.88 21.34,39.88 21.08,39.62 21.08,38.62 TQFP32.18
N$26
  Top 0.406: JP29.6 13.08,12.57 SOIC16.14
  Bottom 0.406: SSOP16.11 12.91,11.64 13.46,12.19 13.46,12.95 JP29.6
N$27
  Top 0.406: JP3.3 35.31,41.66 34.29,40.64 21.08,40.64 20.32,39.88 20.32,38.65 TQFP32.19
N$28  (via drill 0.6)
  Top 0.406: TQFP32.20 19.45,37.7 20.07,37.08 v20.07,35.81
  Bottom 0.406: v20.07,35.81 20.07,36.58 20.57,37.08 27.69,37.08 JP3.4
N$29  (via drill 0.6)
  Top 0.406: TQFP32.21 18.65,37.48 19.05,37.08 v19.05,34.54
  Bottom 0.406: v19.05,34.54 19.05,36.83 20.07,37.85 25.91,37.85 JP3.5
N$30  (via drill 0.6)
  Top 0.406: TQFP32.22 17.85,36.76 v18.03,36.58
  Bottom 0.406: v18.03,36.58 18.03,38.61 18.29,38.86 24.38,38.86 JP3.6
N$31  (via drill 0.6)
  Top 0.305: TQFP32.23 17.05,35.85
  Top 0.406: 17.05,35.85 v17.02,35.31
  Bottom 0.305: v17.02,35.31 17.02,39.37
  Bottom 0.406: 17.02,39.37 17.27,39.62 22.61,39.62 JP3.7
N$32  (via drill 0.6)
  Top 0.406: TQFP32.24 v16.25,37.09 v16.26,37.08
  Bottom 0.406: v16.26,37.08 16.26,39.88 16.76,40.39 20.83,40.39 JP3.8
N$33
  Top 0.406: TQFP32.25 14.76,39.14 15.24,39.62 17.53,39.62 JP3.9
N$34
  Top 0.406: JP3.10 17.53,41.66 16.26,40.39 14.73,40.39 13.46,39.12 13.46,36.83 13.97,36.32 14.72,36.32 TQFP32.26
N$35
  Top 0.406: TQFP32.27 13.53,35.49 12.45,36.58 12.45,39.37 JP3.11
N$36
  Top 0.406: TQFP32.28 13.06,34.69 11.18,36.58 11.18,39.62 12.45,40.89 JP3.12
N$37
  Top 0.406: TQFP32.29 12.34,33.89 9.91,36.32 JP3.13
N$38
  Top 0.406: TQFP32.30 11.11,33.09 7.37,36.83 JP3.14
N$39
  Top 0.406: TQFP32.31 10.13,32.29 4.83,37.59 JP3.15
N$40
  Top 0.406: TQFP32.32 8.9,31.49 2.29,38.1 JP3.16
N$41
  Top 0.406: JP4.1 28.48,20.79 K1.2 K1.3
N$42
  Top 0.406: SOIC16.11 13.08,8.76 JP29.3
  Bottom 0.406: SSOP16.14 12.91,9.69 13.46,9.14 13.46,7.37 13.97,6.86 JP29.3
N$43
  Top 0.406: C41.1 28.19,49.28 JP15.1
  Bottom 0.406: C42.1 28.32,49.15 JP15.1
N$44
  Top 0.406: C41.2 26.67,49.28 JP15.2
  Bottom 0.406: C42.2 26.54,49.15 JP15.2
N$45
  Top 0.406: C44.1 13.08,49.15 JP17.1
  Bottom 0.406: C43.1 12.95,49.28 JP17.1
N$46
  Top 0.406: C44.2 11.3,49.15 JP17.2
  Bottom 0.406: C43.2 11.43,49.28 JP17.2
N$47
  Top 0.406: C46.1 18.92,49.15 JP19.1
  Bottom 0.406: C45.1 19.05,49.28 JP19.1
N$48
  Top 0.406: SOIC16.2 4.83,13.84 3.56,15.11 3.56,15.75 JP28.7
  Bottom 0.406: SSOP16.7 4.98,12.29 4.57,12.7 4.57,16 3.56,17.02 JP28.7
N$49
  Top 0.406: SOIC16.7 4.83,7.49 3.56,6.22 3.56,5.59 JP28.2
  Bottom 0.305: SSOP16.2 4.98,9.04 4.32,8.38 4.32,5.33 3.3,4.32
  Bottom 0.406: 3.3,4.32 JP28.2
N$50
  Top 0.406: C46.2 20.7,49.15 JP19.2
  Bottom 0.406: C45.2 20.57,49.28 JP19.2
N$51
  Top 0.406: SOIC16.15 12.45,13.84 13.72,15.11 13.72,15.75 JP29.7
  Bottom 0.406: SSOP16.10 12.29,12.29 12.7,12.7 12.7,14.73 JP29.7
N$52
  Top 0.406: K1.4 K1.1 27.98,16.29 JP4.2
N$53
  Top 0.406: SOIC16.13 14.35,11.3 JP29.5
  Bottom 0.406: SSOP16.12 14.04,10.99 JP29.5
N$54
  Top 0.406: SOIC16.12 14.35,10.03 JP29.4
  Bottom 0.406: SSOP16.13 14.04,10.34 JP29.4
N$55
  Top 0.406: D1.+ 2.54,53.59 1.52,52.58 1.52,49.53 JP6.1
N$56
  Top 0.406: D1.- 4.45,51.44 R1.1
N$57
  Top 0.406: SOIC16.3 4.19,12.57 JP28.6
  Bottom 0.406: SSOP16.6 4.61,11.64 3.81,12.45 3.81,13.97 3.3,14.48 JP28.6
N$58
  Top 0.406: R1.2 2.79,50.55 4.57,48.77 JP6.2
N$59
  Top 0.406: SOIC16.4 2.92,11.3 JP28.5
  Bottom 0.406: SSOP16.5 3.23,10.99 JP28.5
N$60
  Bottom 0.406: J1.2 JP5.2
N$61
  Bottom 0.406: J1.1 4.14,63.17 JP5.1
N$62
  Bottom 0.406: J1.3 14.14,63.17 JP5.3
N$63
  Top 0.406: JP8.8 60.71,14.99 JP7.1
N$64
  Top 0.406: 63.12,16.89 JP8.7 66.42,13.59 JP7.2
N$65
  Top 0.406: JP8.6 65.79,16.26 67.69,14.35 JP7.3
N$66
  Top 0.406: JP8.5 68.33,15.75 68.96,15.11 JP7.4
N$67
  Top 0.406: JP8.4 70.23,16.13 JP7.5
N$68
  Top 0.406: JP8.3 73.41,16.38 71.5,14.61 JP7.6
N$69
  Top 0.406: JP8.2 75.95,15.62 75.18,14.86 73.66,14.86 72.77,13.97 JP7.7
N$70
  Top 0.406: JP1.1 49.02,2.75 SOT-89.1
  Bottom 0.406: SOT23.2 50.67,3.17 JP1.1
N$71
  Top 0.406: SOIC16.5 2.92,10.03 JP28.4
  Bottom 0.406: SSOP16.4 3.23,10.34 JP28.4
N$72
  Top 0.406: JP8.1 78.49,14.99 76.58,13.08 JP7.8
N$73
  Top 0.61: U1.9 66.68,35.31 Y1.2 63.63,33.02 C1.2
N$74
  Top 0.61: U1.10 69.34,36.2 69.34,33.53 68.58,32.51 Y1.1 66.68,30.73 62.48,30.73 61.98,31.24 C2.2
N$75
  Top 0.406: SOIC16.6 4.19,8.76 JP28.3
  Bottom 0.305: SSOP16.3 4.61,9.69 3.56,8.64 3.56,7.37 3.05,6.86
  Bottom 0.406: 3.05,6.86 JP28.3
N$76
  Top 0.406: JP11.1 59.13,78.95 57.66,77.47 57.66,75.44 57.15,74.93 44.96,74.93 JP12.1
N$77
  Bottom 0.406: JP11.2 56.28,81.38 54.86,82.8 46.99,82.8 45.72,81.53 45.72,76.71 JP12.2
N$78
  Top 0.406: JP11.3 53.59,81.53 52.32,82.8 50.29,82.8 49.53,82.04 49.53,76.96 JP12.3
N$79
  Top 0.406: JP11.4 50.82,76.68 JP12.4
N$80
  Top 0.406: SOIC16.8 5.56,5.05 JP28.1
  Bottom 0.406: SSOP16.1 5.71,3.93 3.56,1.78 JP28.1
N$82
  Bottom 0.406: JP11.5 48.05,79.71 49.02,78.74 51.31,78.74 JP12.5
N$83
  Top 0.406: JP11.6 57.74,79.08 56.39,77.72 JP12.6
N$84
  Top 0.406: JP11.7 54.97,84.69 56.13,85.85 58.67,85.85 60.71,83.82 60.71,77.98 JP12.7
N$85
  Bottom 0.406: JP11.8 52.21,84.47 53.59,85.85 58.93,85.85 61.47,83.31 JP12.8
N$86
  Top 0.406: JP12.9 61.98,78.23 61.98,83.82 59.18,86.61 51.58,86.61 JP11.9
N$87
  Top 0.406: JP13.1 10.46,80.82 JP16.1
N$88
  Top 0.406: JP13.2 13.23,81.05 JP16.2
N$89
  Top 0.406: JP13.3 16,81.28 JP16.3
N$90
  Top 0.406: JP13.4 18.65,81.38 JP16.4
N$91
  Top 0.406: JP13.5 21.19,81.38 JP16.5
N$92
  Bottom 0.305: 14.48,82.3 14.48,80.26
  Bottom 0.406: JP13.6 12.55,84.22 14.48,82.3 | 14.48,80.26 JP16.6
N$93
  Bottom 0.406: JP13.7 15.34,84.22 17.27,82.3 17.27,80.01 JP16.7
N$94
  Bottom 0.406: JP13.8 18.14,84.22 20.07,82.3 20.07,79.76 JP16.8
N$95
  Bottom 0.406: JP13.9 20.93,84.22 23.11,82.04 23.11,79.25 JP16.9
N$96  (via drill 1.4)
  other vias: 46.74,65.28
N$97
  Top 0.406: SOIC16.10 12.45,7.49 13.72,6.22 13.72,5.59 JP29.2
  Bottom 0.406: SSOP16.15 12.29,9.04 12.7,8.64 12.7,5.59 13.97,4.32 JP29.2
N$98  (via drill 1.4)
  other vias: 49.28,65.28
N$99  (via drill 1.4)
  other vias: 51.82,65.28
N$100  (via drill 1.4)
  other vias: 54.36,65.28
N$101  (via drill 1.4)
  other vias: 56.9,65.28
N$102  (via drill 1.4)
  other vias: 59.44,65.28
N$103
  Top 0.406: K2.3 K2.2 28.48,6.06 JP20.1
N$104
  Top 0.406: K2.4 K2.1 27.98,1.56 JP20.2
N$105
  Top 0.406: JP27.1 34.8,48.26 34.8,50.66 arc-45 34.98,51.11 D2.+
N$106
  Top 0.406: R3.1 37.85,52.52 arc-45 D2.-
N$107
  Top 0.406: JP25.2 SOT223.2 SOT223.TER
N$108
  Top 0.406: R3.2 36.32,49.54 arc45 36.51,49.09 JP27.2
N$111
  Top 0.406: JP29.8 11.81,16.38 11.81,15.22 SOIC16.16
  Bottom 0.406: SSOP16.9 11.56,17.91 13.21,19.56 JP29.8
N$304
  Top 0.406: SOT223.1 34.29,11.94 JP25.1
N$306
  Top 0.406: SOT223.3 38.86,11.94 JP25.3
VCC
  Top 0.406: SOIC16.9 11.71,5.05 JP29.1
  Bottom 0.406: SSOP16.16 11.56,3.68 13.46,1.78 JP29.1

### Text on the board
Top: PROTOPACK V1.0
tNames: DB9 FEMALE / BREAKOUT | DB9 MALE / BREAKOUT | 1 | 2 | 3 | 4 | 5 | 6 | 7 | 8 | 9 | 1 | 2 | 3 | 4 | 5 | 6 | 7 | 8 | 9 | DTR | RX | TX | VCC | CTS | GND | FTDI / ADAPTER | FTDI / ADAPTER | SIGNAL | GND | SIGNAL | GND | A5 | A4 | A3 | A2 | A1 | A0 | VCC | GND | GND | D13 | SCK | D12 | MISO | D11~ | MOSI | D10~ | VCC | 32 | 17 | 1 | 16 | GND | RESET | D0 | RX | D1 | TX | D2 | D3~ | D4 | D5~ | D6~ | D7 | D8 | AREF | GND | VCC | MOSI | GND | 1 | 16 | W/ORG | ORG | W/GRN | BLUE | W/BLUE | GRN | W/BRN | BRN | VCC | MOSI | GND | MISO | SCK | RESET | 2 | 15 | 3 | 14 | 1 | 8 | 4 | 13 | MISO | SCK | RESET | VCC | MOSI | GND | 5 | 12 | 6 | 11 | RJ45-breakout | MISO | SCK | RESET | 7 | 10 | 8 | 9